# EAGLE schematic Nusbio SPI Extension (EAGLE 9.6.2)
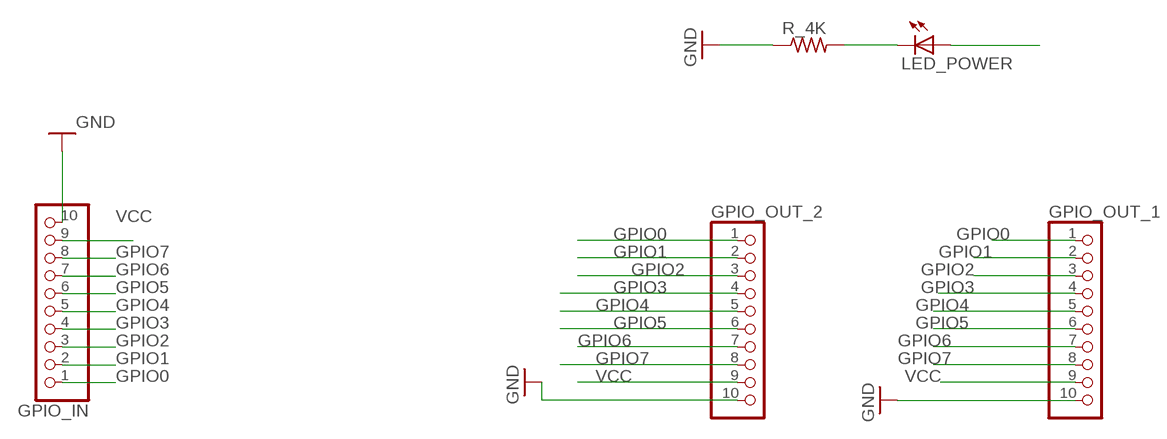
[diagram p0: schematic, sheet 1]

## Parts
GPIO_IN  PINHD-1X10  [1X10-BIG]
GPIO_OUT_1  PINHD-1X10  [1X10-BIG]
GPIO_OUT_2  PINHD-1X10  [1X10-BIG]
LED_POWER  LEDSMT1206  [1206]
R_4K  R-US_R1206  [R1206]

## Nets
GND: GPIO_IN.10 GPIO_OUT_1.10 GPIO_OUT_2.10 R_4K.1
GPIO0: GPIO_IN.1 GPIO_OUT_1.1 GPIO_OUT_2.1
GPIO1: GPIO_IN.2 GPIO_OUT_1.2 GPIO_OUT_2.2
GPIO2: GPIO_IN.3 GPIO_OUT_1.3 GPIO_OUT_2.3
GPIO3: GPIO_IN.4 GPIO_OUT_1.4 GPIO_OUT_2.4
GPIO4: GPIO_IN.5 GPIO_OUT_1.5 GPIO_OUT_2.5
GPIO5: GPIO_IN.6 GPIO_OUT_1.6 GPIO_OUT_2.6
GPIO6: GPIO_IN.7 GPIO_OUT_1.7 GPIO_OUT_2.7
GPIO7: GPIO_IN.8 GPIO_OUT_1.8 GPIO_OUT_2.8
N$2: LED_POWER.C R_4K.2
VCC: GPIO_IN.9 GPIO_OUT_1.9 GPIO_OUT_2.9 LED_POWER.A

## Library data of the parts
GPIO_IN GPIO_OUT_1 GPIO_OUT_2 = adafruit:PINHD-1X10: Pin header 1x10 0.1" spacing With round pins
LED_POWER = adafruit:LED: LED OSRAM: - CHIPLED LG R971, LG N971, LY N971, LG Q971, LY Q971, LO R971, LY R971 LH N974, LH R974 LS Q976, LO Q976, LY Q976 LO Q996 - Hyper CHIPLED LW Q18S LB Q993, LB Q99A, LB R99A - SideLED LS A670, LO A670, LY A670, LG A670, LP A670 LB A673, LV A673, LT A673, LW A673 LH A674 LY A675 LS A676, LA A676, LO A676, LY A676, LW A676 LS A679, LY A679, LG A679 - Hyper Micro SIDELED® LS Y876, LA Y876, LO Y876, LY Y876 LT Y87S - SmartLED LW L88C, LW L88S LB L89C, LB L89S, LG L890 LS L89K, LO L89K, LY L89K LS L896, LA L896, LO L896, LY L896 - TOPLED LS T670, LO T670, LY T670, LG T670, LP T670 LSG T670, LSP T670, LSY T670, LOP T670, LYG T670 LG T671, LOG T671, LSG T671 LB T673, LV T673, LT T673, LW T673 LH T674 LS T676, LA T676, LO T676, LY T676, LB T676, LH T676, LSB T676, LW T676 LB T67C, LV T67C, LT T67C, LS T67K, LO T67K, LY T67K, LW E67C LS E67B, LA E67B, LO E67B, LY E67B, LB E67C, LV E67C, LT E67C LW T67C LS T679, LY T679, LG T679 LS T770, LO T770, LY T770, LG T770, LP T770 LB T773, LV T773, LT T773, LW T773 LH T774 LS E675, LA E675, LY E675, LS T675 LS T776, LA T776, LO T776, LY T776, LB T776 LHGB T686 LT T68C, LB T68C - Hyper Mini TOPLED® LB M676 - Mini TOPLED Santana® LG M470 LS M47K, LO M47K, LY M47K Source: http://www.osram.convergy.de/
R_4K = adafruit:R-US_: RESISTOR, American symbol